# Altium project RN2483_carrier_board.PrjPcb
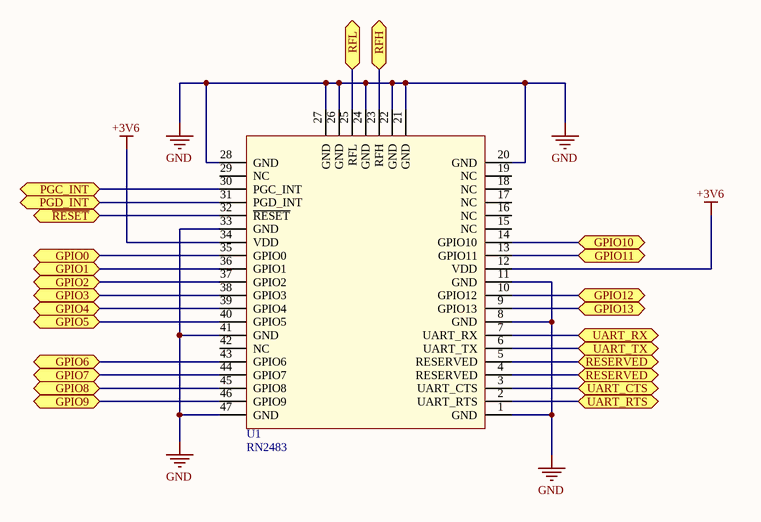
[diagram p0: RN2483.SchDoc]
2 sheets, 5 parts. Net scope: flat (ports and power ports of the same name join across sheets).
Sheets:
  RN2483.SchDoc
  Connectors.SchDoc

## Sheet RN2483.SchDoc
size A4

### Parts
U1  RN2483  [RN2483]

### Ports
GPIO0, GPIO1, GPIO2, GPIO3, GPIO4, GPIO5, GPIO6, GPIO7, GPIO8, GPIO9, GPIO10, GPIO11, GPIO12, GPIO13, PGC_INT, PGD_INT, RESERVED, RFH, RFL, UART_CTS, UART_RTS, UART_RX, UART_TX, ~{RESET}

### Nets
+3V6: U1.12(VDD) U1.34(VDD)
GND: U1.1(GND) U1.8(GND) U1.11(GND) U1.20(GND) U1.21(GND) U1.22(GND) U1.24(GND) U1.26(GND) U1.27(GND) U1.28(GND) U1.33(GND) U1.41(GND) U1.47(GND)
NetJ1_1: U1.23(RFH) ; port RFH
NetJ2_1: U1.25(RFL) ; port RFL
NetP1_2: U1.2(UART_RTS) ; port UART_RTS
NetP1_3: U1.3(UART_CTS) ; port UART_CTS
NetP1_4: U1.4(RESERVED) U1.5(RESERVED) ; port RESERVED
NetP1_6: U1.6(UART_TX) ; port UART_TX
NetP1_7: U1.7(UART_RX) ; port UART_RX
NetP1_9: U1.9(GPIO13) ; port GPIO13
NetP1_10: U1.10(GPIO12) ; port GPIO12
NetP1_13: U1.13(GPIO11) ; port GPIO11
NetP1_14: U1.14(GPIO10) ; port GPIO10
NetP2_1: U1.30(PGC_INT) ; port PGC_INT
NetP2_2: U1.31(PGD_INT) ; port PGD_INT
NetP2_3: U1.32(~{RESET}) ; port ~{RESET}
NetP2_6: U1.35(GPIO0) ; port GPIO0
NetP2_7: U1.36(GPIO1) ; port GPIO1
NetP2_8: U1.37(GPIO2) ; port GPIO2
NetP2_9: U1.38(GPIO3) ; port GPIO3
NetP2_10: U1.39(GPIO4) ; port GPIO4
NetP2_11: U1.40(GPIO5) ; port GPIO5
NetP2_12: U1.43(GPIO6) ; port GPIO6
NetP2_13: U1.44(GPIO7) ; port GPIO7
NetP2_14: U1.45(GPIO8) ; port GPIO8
NetP2_15: U1.46(GPIO9) ; port GPIO9

Not connected (* = marked no-connect by the designer): U1 15(NC) 16(NC) 17(NC) 18(NC) 19(NC) 29(NC) 42(NC)

### Library data of the parts
U1 = RN2483: Low-Power Long Range LoRa® Technology  Transceiver Module; Value: RN2483

## Sheet Connectors.SchDoc
size A4
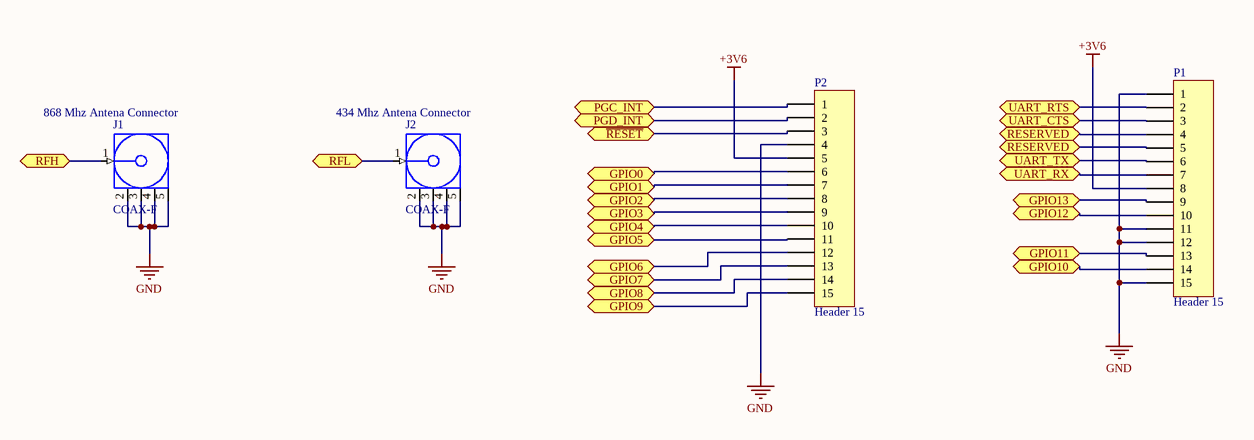
[diagram p1: Connectors.SchDoc]

### Parts
J1  COAX-F  [MCX5.08-H5]
J2  COAX-F  [MCX5.08-H5]
P1  Header 15  [HDR1X15]
P2  Header 15  [HDR1X15]

### Ports
GPIO0, GPIO1, GPIO2, GPIO3, GPIO4, GPIO5, GPIO6, GPIO7, GPIO8, GPIO9, GPIO10, GPIO11, GPIO12, GPIO13, PGC_INT, PGD_INT, RESERVED, RFH, RFL, UART_CTS, UART_RTS, UART_RX, UART_TX, ~{RESET}

### Nets
+3V6: P1.8 P2.5
GND: J1.2(GND) J1.3(GND) J1.4(GND) J1.5(GND) J2.2(GND) J2.3(GND) J2.4(GND) J2.5(GND) P1.1 P1.11 P1.12 P1.15 P2.4
NetJ1_1: J1.1(Signal) ; port RFH
NetJ2_1: J2.1(Signal) ; port RFL
NetP1_2: P1.2 ; port UART_RTS
NetP1_3: P1.3 ; port UART_CTS
NetP1_4: P1.4 P1.5 ; port RESERVED
NetP1_6: P1.6 ; port UART_TX
NetP1_7: P1.7 ; port UART_RX
NetP1_9: P1.9 ; port GPIO13
NetP1_10: P1.10 ; port GPIO12
NetP1_13: P1.13 ; port GPIO11
NetP1_14: P1.14 ; port GPIO10
NetP2_1: P2.1 ; port PGC_INT
NetP2_2: P2.2 ; port PGD_INT
NetP2_3: P2.3 ; port ~{RESET}
NetP2_6: P2.6 ; port GPIO0
NetP2_7: P2.7 ; port GPIO1
NetP2_8: P2.8 ; port GPIO2
NetP2_9: P2.9 ; port GPIO3
NetP2_10: P2.10 ; port GPIO4
NetP2_11: P2.11 ; port GPIO5
NetP2_12: P2.12 ; port GPIO6
NetP2_13: P2.13 ; port GPIO7
NetP2_14: P2.14 ; port GPIO8
NetP2_15: P2.15 ; port GPIO9

### Notes on the sheet
- (near J1) 868 Mhz Antena Connector
- (near J2) 434 Mhz Antena Connector

### Library data of the parts
J1 J2 = COAX-F: RF Coaxial PCB Connector, MCX; Thru-Hole, Right-Angle Mount Socket, Blunt Post Terminal, 50 Ohm Impedance; PCB_Layout: Complies with manufacturer's recommendation.; DrillSize: Corresponds to nominal value.; Published: 15-Jul-2004; LatestRevisionDate: 15-Jul-2004; LatestRevisionNote: Component Replaced.; DatasheetDocument: 30-May-2003; PackageDocument: 04-Jul-1999; PackageReference: 919-119J-51AX; Publisher: Altium Limited; ComponentLink1Description: Manufacturer Link; ComponentLink1URL: http://www.amphenolrf.com/
P1 P2 = Header 15: Header, 15-Pin; LatestRevisionDate: 17-Jul-2002; LatestRevisionNote: Re-released for DXP Platform.; Publisher: Altium Limited

## Nets that join several sheets
+3V6: RN2483 (U1.12 U1.34), Connectors (P1.8 P2.5)
GND: RN2483 (13 pins), Connectors (13 pins)
NetJ1_1: RN2483 (U1.23), Connectors (J1.1)
NetJ2_1: RN2483 (U1.25), Connectors (J2.1)
NetP1_2: RN2483 (U1.2), Connectors (P1.2)
NetP1_3: RN2483 (U1.3), Connectors (P1.3)
NetP1_4: RN2483 (U1.4 U1.5), Connectors (P1.4 P1.5)
NetP1_6: RN2483 (U1.6), Connectors (P1.6)
NetP1_7: RN2483 (U1.7), Connectors (P1.7)
NetP1_9: RN2483 (U1.9), Connectors (P1.9)
NetP1_10: RN2483 (U1.10), Connectors (P1.10)
NetP1_13: RN2483 (U1.13), Connectors (P1.13)
NetP1_14: RN2483 (U1.14), Connectors (P1.14)
NetP2_1: RN2483 (U1.30), Connectors (P2.1)
NetP2_2: RN2483 (U1.31), Connectors (P2.2)
NetP2_3: RN2483 (U1.32), Connectors (P2.3)
NetP2_6: RN2483 (U1.35), Connectors (P2.6)
NetP2_7: RN2483 (U1.36), Connectors (P2.7)
NetP2_8: RN2483 (U1.37), Connectors (P2.8)
NetP2_9: RN2483 (U1.38), Connectors (P2.9)
NetP2_10: RN2483 (U1.39), Connectors (P2.10)
NetP2_11: RN2483 (U1.40), Connectors (P2.11)
NetP2_12: RN2483 (U1.43), Connectors (P2.12)
NetP2_13: RN2483 (U1.44), Connectors (P2.13)
NetP2_14: RN2483 (U1.45), Connectors (P2.14)
NetP2_15: RN2483 (U1.46), Connectors (P2.15)